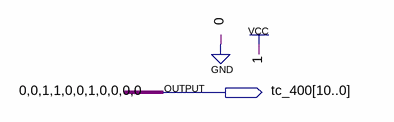
[diagram p0: schematic sheet]
// Quartus schematic tc_400.bdf as structural Verilog: 0 symbols, 1 pins
module tc_400 (
  output [10:0] tc_400
);


  assign tc_400 = 11'b00110010000;
endmodule
